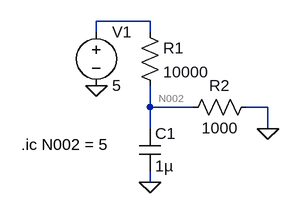
[diagram p0: schematic Button_Debounce.asc]
Button_Debounce.asc, the LTspice schematic file:
Version 4
SHEET 1 880 680
WIRE 336 -32 256 -32
WIRE 256 -16 256 -32
WIRE 336 -16 336 -32
WIRE 336 96 336 64
WIRE 400 96 336 96
WIRE 512 96 480 96
WIRE 336 128 336 96
WIRE 512 128 512 96
WIRE 336 208 336 192
FLAG 512 128 0
FLAG 336 208 0
FLAG 256 64 0
SYMBOL cap 320 128 R0
SYMATTR InstName C1
SYMATTR Value 1µ
SYMBOL res 320 -32 R0
SYMATTR InstName R1
SYMATTR Value 10000
SYMBOL res 496 80 R90
WINDOW 0 0 56 VBottom 2
WINDOW 3 32 56 VTop 2
SYMATTR InstName R2
SYMATTR Value 1000
SYMBOL voltage 256 -32 R0
WINDOW 123 0 0 Left 0
WINDOW 39 0 0 Left 0
SYMATTR InstName V1
SYMATTR Value 5
TEXT 144 152 Left 2 !.ic N002 = 5

The netlist it stands for:
* Button_Debounce.asc
C1 N002 0 1µ
R1 N001 N002 10000
R2 0 N002 1000
V1 N001 0 5
.ic N002 = 5
.backanno
.end